# EAGLE design solarvoltagelimit (EAGLE 5.11)
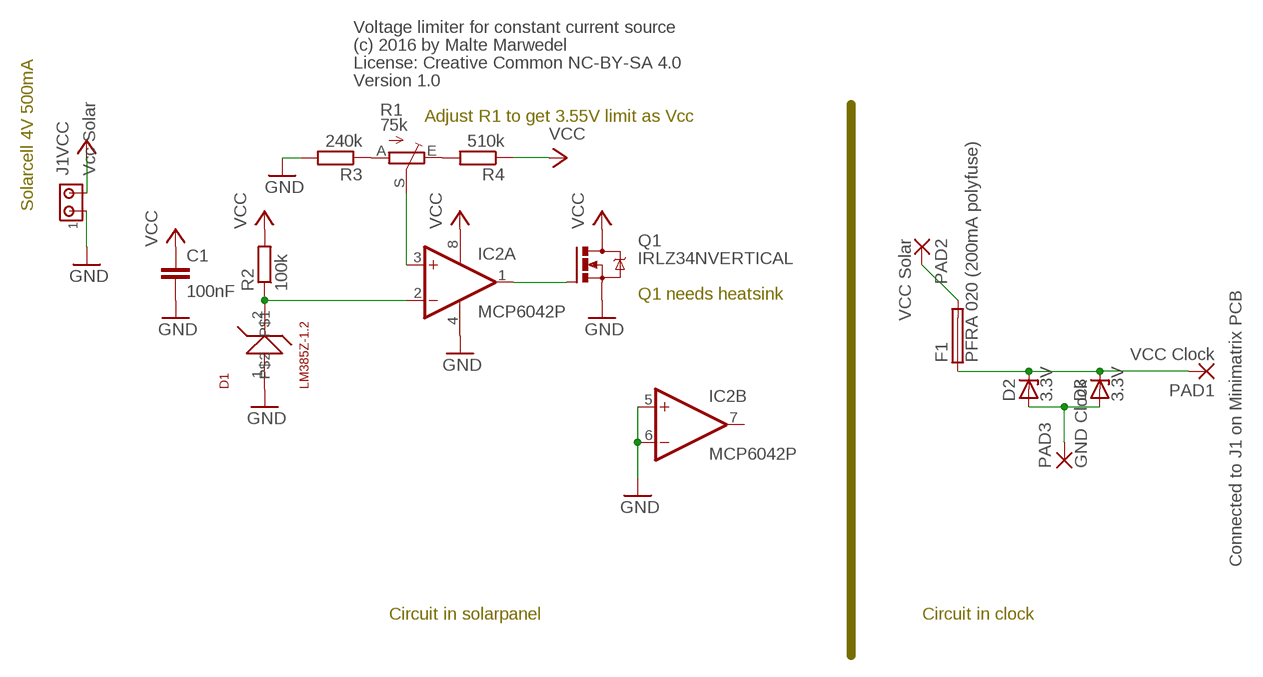
[diagram p0: schematic, sheet 1]

## Parts
C1  100nF  C-EU025-024X044  [C025-024X044]
D1  LM385Z-1.2  LM258Z  [TO92L]
D2  3.3V  ZENER-DIODEDO35Z10  [DO35Z10]
D3  3.3V  ZENER-DIODEDO35Z10  [DO35Z10]
F1  PFRA 020 (200mA polyfuse)  TR5  [TR5]
IC2  MCP6042P  MCP602P  [DIL08]
J1  Vcc Solar  MTA02-100  [RM3.5X02MTA]
PAD1  VCC Clock  1,6/0,8  [1,6/0,8]
PAD2  VCC Solar  1,6/0,8  [1,6/0,8]
PAD3  GND Clock  1,6/0,8  [1,6/0,8]
Q1  IRLZ34NVERTICAL  IRLZ44ZVERTICAL  [TO220BV]
R1  75k  TRIM_EU-CA6H  [CA6H]
R2  100k  R-EU_0207/2V  [0207/2V]
R3  240k  R-EU_0207/2V  [0207/2V]
R4  510k  R-EU_0207/2V  [0207/2V]

## Nets
GND: C1.2 D1.1 IC2.4(P:V-) IC2.5(B:+IN) IC2.6(B:-IN) J1.1 Q1.S R3.2
N$1: IC2.1(A:OUT) Q1.G
N$2: IC2.3(A:+IN) R1.S
N$3: D1.2 IC2.2(A:-IN) R2.1
N$4: R1.A R3.1
N$5: R1.E R4.2
N$6: D2.C D3.C F1.1 PAD1.1(P)
N$7: D2.A D3.A PAD3.1(P)
VCC: C1.1 IC2.8(P:V+) J1.2 Q1.D R2.2 R4.1
VCC2: F1.2 PAD2.1(P)
Unconnected: IC2.7(B:OUT)

## Notes on the sheet
- Voltage limiter for constant current source
- (c) 2016 by Malte Marwedel
- License: Creative Common NC-BY-SA 4.0
- Version 1.0
- Adjust R1 to get 3.55V limit as Vcc
- Solarcell 4V 500mA
- Q1 needs heatsink
- Connected to J1 on Minimatrix PCB
- Circuit in solarpanel | Circuit in clock

## Library data of the parts
C1 = rcl:C-EU: CAPACITOR, European symbol
D1 = maltes2_lib:LM258Z: LM185Z / LM285Z / LM385Z Micropower voltage reference diode LM285Z-1.2 -> 1,25V ref voltage.
D2 D3 = diode:ZENER-DIODE: Z-Diode
F1 = fuse:TR5: FUSE Wickmann; OC_FARNELL: unknown; OC_NEWARK: unknown
IC2 = linear:MCP602: Single Op Amp 2.7V to 6.0V Single Supply CMOS Source: http://ww1.microchip.com/downloads/en/DeviceDoc/21314g.pdf
J1 = maltes2_lib:MTA02-100: AMP connector; OC_FARNELL: unknown; OC_NEWARK: unknown
PAD1-PAD3 = wirepad:1,6/0,8: THROUGH-HOLE PAD
Q1 = maltes2_lib:IRLZ44Z: N-Channel HEXFET® Power MOSFET Logic Level AUTOMOTIVE MOSFET Source: http://www.irf.com/product-info/datasheets/data/irlz44zpbf.pdf
R1 = pot:TRIM_EU-: POTENTIOMETER
R2-R4 = rcl:R-EU_: RESISTOR, European symbol

## Board
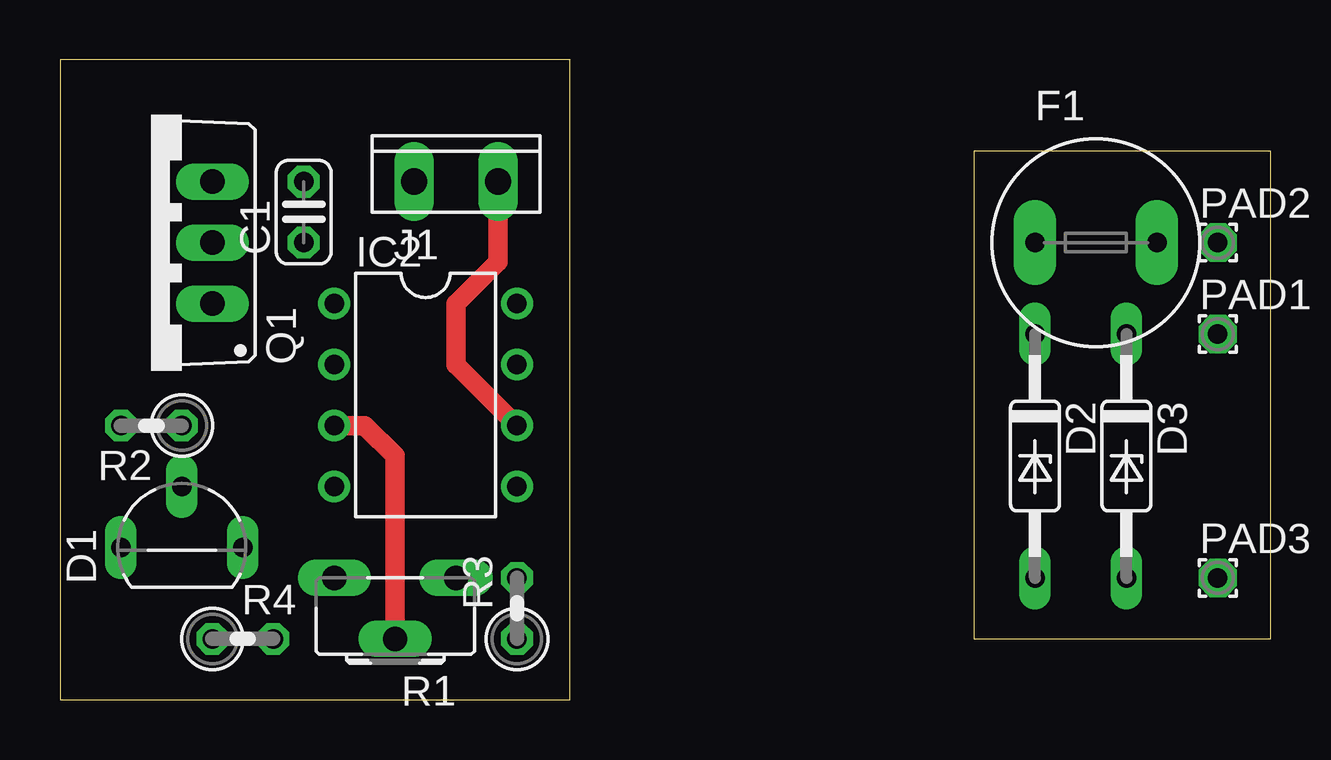
[diagram p1: board, top side]
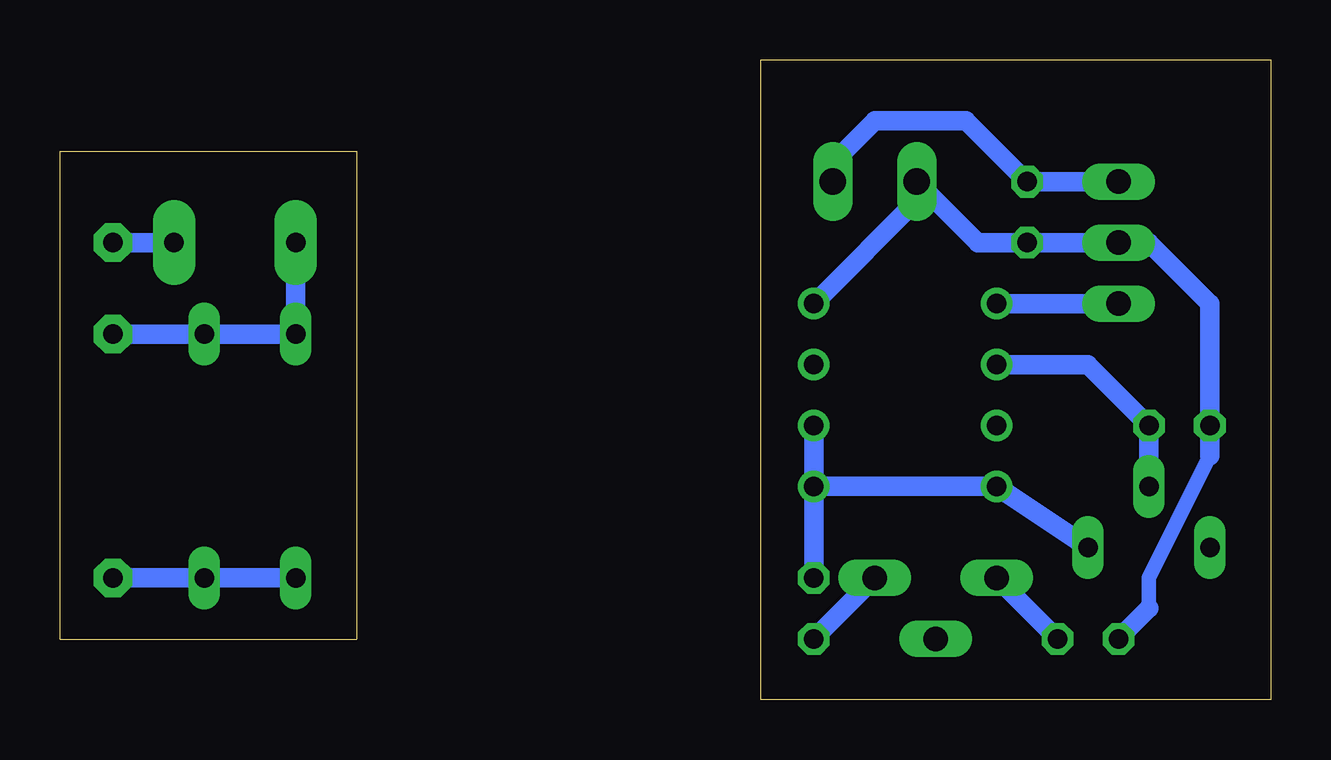
[diagram p2: board, bottom side, seen from below]

Size 50.47 x 26.66 mm. Coordinates in mm from the lower left corner, seen from the top.
Outline: 0,0 21.26,0 21.26,26.66 0,26.66 0,0
Outline: 38.1,22.85 38.1,2.53 50.47,2.53 50.47,22.85 38.1,22.85
Copper layers (1*16): Top 0.035mm / dielectric 1.5mm / Bottom 0.035mm
Design rules "default": minimum track width 10mil, minimum drill 24mil, track to track 8mil, track to pad 8mil, pad to pad 8mil, via to via 8mil, smd to smd 8mil, copper to edge 40mil, drill to drill 8mil, minimum pad ring 10mil, minimum via ring 8mil, stop-mask expansion 4mil, vias tented up to drill 0mil, thermal gap 10mil

### Footprints (pad centres in the part's own frame; a part is rotated, then mirrored left to right if it is on the bottom)
C025-024X044 = drill 0.813 octagon: 1 -1.27,0; 2 1.27,0
TO92L = drill 0.813 long: 1 0,-2.54; 2 2.54,0; 3 0,2.54
DO35Z10 = drill 0.813 long: A 5.08,0; C -5.08,0
TR5 = drill 0.813 pad 1.778 long: 1 -2.54,0; 2 2.54,0
DIL08 = drill 0.813 pad 1.27 round: 1 -3.81,-3.81; 2 -1.27,-3.81; 3 1.27,-3.81; 4 3.81,-3.81; 5 3.81,3.81; 6 1.27,3.81; 7 -1.27,3.81; 8 -3.81,3.81
RM3.5X02MTA = drill 1.1 long: 1 1.75,0; 2 -1.75,0
1,6/0,8 = drill 0.813 pad 1.6 octagon: 1 0,0
TO220BV = drill 1.016 long: D 0,-2.54; G -2.54,-2.54; S 2.54,-2.54
CA6H = drill 1.016 long: A -2.54,0; E 2.54,0; S 0,2.54
0207/2V = drill 0.813 octagon: 1 -1.27,0; 2 1.27,0

### Placement (x,y rotation side)
C1  10.16,20.32 90 top
D1  5.08,6.35 90 top
D2  40.64,10.16 270 top
D3  44.45,10.16 270 top
F1  43.18,19.05 0 top
IC2  15.24,12.7 270 top
J1  16.51,21.59 0 top
PAD1  48.26,15.24 0 top
PAD2  48.26,19.05 0 top
PAD3  48.26,5.08 0 top
Q1  3.81,19.05 90 top
R1  13.97,5.08 180 top
R2  3.81,11.43 180 top
R3  19.05,3.81 90 top
R4  7.62,2.54 0 top

### Tracks (layer width: path | path; a pad name or v marks a point on that pad's centre or on a via)
GND
  Top 0.813: IC2.6 16.51,13.97 16.51,16.51 18.26,18.26 J1.1
  Bottom 0.813: IC2.5 IC2.6 | Q1.S C1.2 12.7,24.13 16.51,24.13 18.26,22.38 J1.1 | D1.1 IC2.4 IC2.5 | IC2.5 R3.2
N$1
  Bottom 0.813: Q1.G IC2.1
N$2
  Top 0.813: IC2.3 12.7,11.43 13.97,10.16 R1.S
N$3
  Bottom 0.813: IC2.2 7.62,13.97 R2.1 D1.2
N$4
  Bottom 0.813: R1.A R3.1
N$5
  Bottom 0.813: R4.2 R1.E
N$6
  Bottom 0.813: PAD1.1 D3.C D2.C F1.1
N$7
  Bottom 0.813: D2.A D3.A PAD3.1
VCC
  Bottom 0.61: 2.54,10.16 5.08,5.08 5.08,3.81
  Bottom 0.813: IC2.8 14.61,20.95 14.76,21.11 J1.2 12.22,19.05 C1.1 Q1.D 5.08,19.05 2.54,16.51 R2.2 2.54,10.16 | R4.1 5.08,3.81
VCC2
  Bottom 0.813: F1.2 PAD2.1